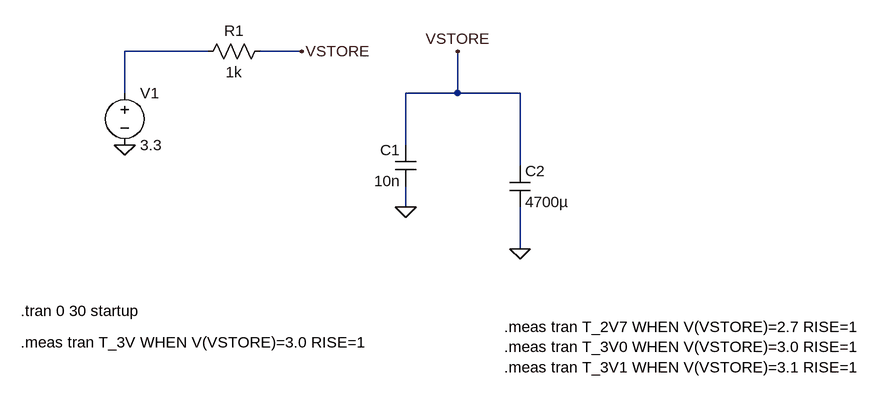
[diagram p0: schematic Stage1B_0p47F_Charging.asc]
Stage1B_0p47F_Charging.asc, the LTspice schematic file:
Version 4.1
SHEET 1 1272 680
WIRE 160 80 32 80
WIRE 304 80 240 80
WIRE 32 144 32 80
WIRE 544 144 544 80
WIRE 544 144 464 144
WIRE 640 144 544 144
WIRE 464 224 464 144
WIRE 640 256 640 144
WIRE 464 320 464 288
WIRE 640 384 640 320
FLAG 32 224 0
FLAG 304 80 VSTORE
FLAG 544 80 VSTORE
FLAG 640 384 0
FLAG 464 320 0
SYMBOL voltage 32 128 R0
SYMATTR InstName V1
SYMATTR Value 3.3
SYMBOL res 256 64 R90
WINDOW 0 0 56 VBottom 2
WINDOW 3 32 56 VTop 2
SYMATTR InstName R1
SYMATTR Value 1k
SYMBOL cap 480 288 R180
WINDOW 0 24 56 Left 2
WINDOW 3 24 8 Left 2
SYMATTR InstName C1
SYMATTR Value 10n
SYMBOL cap 624 256 R0
SYMATTR InstName C2
SYMATTR Value 4700µ
TEXT -128 480 Left 2 !.tran 0 30 startup
TEXT -128 528 Left 2 !.meas tran T_3V WHEN V(VSTORE)=3.0 RISE=1
TEXT 616 504 Left 2 !.meas tran T_2V7 WHEN V(VSTORE)=2.7 RISE=1\n.meas tran T_3V0 WHEN V(VSTORE)=3.0 RISE=1\n.meas tran T_3V1 WHEN V(VSTORE)=3.1 RISE=1

The netlist it stands for:
* Stage1B_0p47F_Charging.asc
V1 N001 0 3.3
R1 VSTORE N001 1k
C1 0 VSTORE 10n
C2 VSTORE 0 4700µ
.tran 0 30 startup
.meas tran T_3V WHEN V(VSTORE)=3.0 RISE=1
.meas tran T_2V7 WHEN V(VSTORE)=2.7 RISE=1
.meas tran T_3V0 WHEN V(VSTORE)=3.0 RISE=1
.meas tran T_3V1 WHEN V(VSTORE)=3.1 RISE=1
.backanno
.end